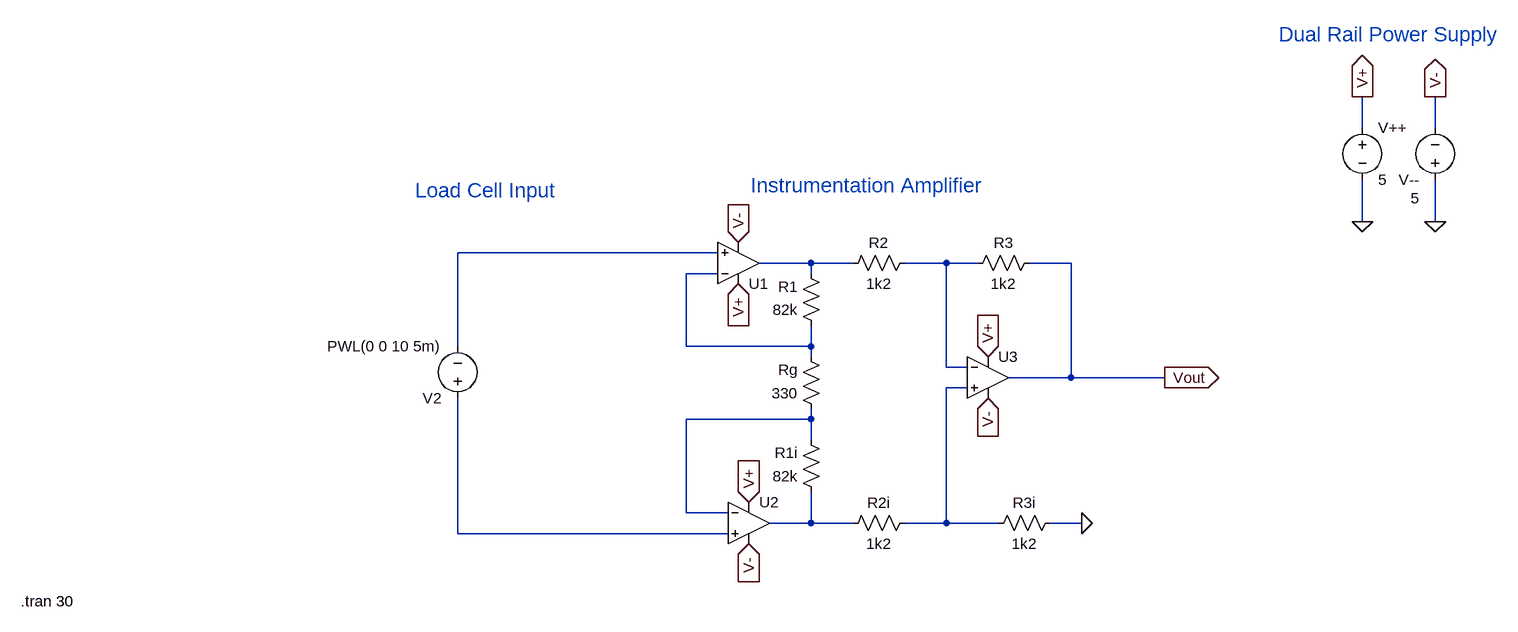
[diagram p0: schematic InstAmp.asc]
InstAmp.asc, the LTspice schematic file:
Version 4
SHEET 1 1172 680
WIRE 960 -176 960 -224
WIRE 1072 -176 1072 -224
WIRE 960 -32 960 -96
WIRE 1072 -32 1072 -96
WIRE -32 16 -432 16
WIRE 112 32 32 32
WIRE 176 32 112 32
WIRE 320 32 256 32
WIRE 368 32 320 32
WIRE 512 32 448 32
WIRE -32 48 -80 48
WIRE 112 48 112 32
WIRE -432 160 -432 16
WIRE -80 160 -80 48
WIRE 112 160 112 128
WIRE 112 160 -80 160
WIRE 112 176 112 160
WIRE 320 192 320 32
WIRE 352 192 320 192
WIRE 512 208 512 32
WIRE 512 208 416 208
WIRE 656 208 512 208
WIRE 352 224 320 224
WIRE 112 272 112 256
WIRE 112 272 -80 272
WIRE 112 304 112 272
WIRE -80 416 -80 272
WIRE -16 416 -80 416
WIRE 112 432 112 384
WIRE 112 432 48 432
WIRE 176 432 112 432
WIRE 320 432 320 224
WIRE 320 432 256 432
WIRE 400 432 320 432
WIRE 528 432 480 432
WIRE -432 448 -432 240
WIRE -16 448 -432 448
FLAG 528 432 0
FLAG 656 208 Vout
IOPIN 656 208 Out
FLAG 960 -224 V+
IOPIN 960 -224 Out
FLAG 1072 -224 V-
IOPIN 1072 -224 Out
FLAG 960 -32 0
FLAG 1072 -32 0
FLAG 384 240 V-
IOPIN 384 240 In
FLAG 16 464 V-
IOPIN 16 464 In
FLAG 0 0 V-
IOPIN 0 0 In
FLAG 0 64 V+
IOPIN 0 64 In
FLAG 16 400 V+
IOPIN 16 400 In
FLAG 384 176 V+
IOPIN 384 176 In
SYMBOL OpAmps\\UniversalOpAmp 0 32 M180
SYMATTR InstName U1
SYMBOL OpAmps\\UniversalOpAmp 16 432 R0
SYMATTR InstName U2
SYMBOL OpAmps\\UniversalOpAmp 384 208 R0
SYMATTR InstName U3
SYMBOL res 128 144 R180
WINDOW 0 36 76 Left 2
WINDOW 3 36 40 Left 2
SYMATTR InstName R1
SYMATTR Value 82k
SYMBOL res 128 272 R180
WINDOW 0 36 76 Left 2
WINDOW 3 36 40 Left 2
SYMATTR InstName Rg
SYMATTR Value 330
SYMBOL res 128 400 R180
WINDOW 0 36 76 Left 2
WINDOW 3 36 40 Left 2
SYMATTR InstName R1i
SYMATTR Value 82k
SYMBOL res 160 48 R270
WINDOW 0 32 56 VTop 2
WINDOW 3 0 56 VBottom 2
SYMATTR InstName R2
SYMATTR Value 1k2
SYMBOL res 160 448 R270
WINDOW 0 32 56 VTop 2
WINDOW 3 0 56 VBottom 2
SYMATTR InstName R2i
SYMATTR Value 1k2
SYMBOL res 384 448 R270
WINDOW 0 32 56 VTop 2
WINDOW 3 0 56 VBottom 2
SYMATTR InstName R3i
SYMATTR Value 1k2
SYMBOL res 352 48 R270
WINDOW 0 32 56 VTop 2
WINDOW 3 0 56 VBottom 2
SYMATTR InstName R3
SYMATTR Value 1k2
SYMBOL voltage 960 -192 R0
WINDOW 123 0 0 Left 0
WINDOW 39 0 0 Left 0
SYMATTR InstName V++
SYMATTR Value 5
SYMBOL voltage 1072 -80 R180
WINDOW 3 24 -12 Left 2
WINDOW 123 0 0 Left 0
WINDOW 39 0 0 Left 0
SYMATTR Value 5
SYMATTR InstName V--
SYMBOL voltage -432 256 R180
WINDOW 123 24 68 Left 2
WINDOW 39 0 0 Left 0
SYMATTR InstName V2
SYMATTR Value PWL(0 0 10 5m)
TEXT 1168 -320 Right 3 ;Dual Rail Power Supply
TEXT 376 -88 Right 3 ;Instrumentation Amplifier
TEXT -280 -80 Right 3 ;Load Cell Input
TEXT -1104 552 Left 2 !.tran 30

The netlist it stands for:
* InstAmp.asc
XU1 N001 N004 V+ V- N002 level1 Avol=1Meg GBW=10Meg Vos=0 En=0 Enk=0 In=0 Ink=0 Rin=500Meg  ; pins In+ In- V+ V- OUT
XU2 N008 N006 V+ V- N007 level1 Avol=1Meg GBW=10Meg Vos=0 En=0 Enk=0 In=0 Ink=0 Rin=500Meg  ; pins In+ In- V+ V- OUT
XU3 N005 N003 V+ V- Vout level1 Avol=1Meg GBW=10Meg Vos=0 En=0 Enk=0 In=0 Ink=0 Rin=500Meg  ; pins In+ In- V+ V- OUT
R1 N004 N002 82k
Rg N006 N004 330
R1i N007 N006 82k
R2 N002 N003 1k2
R2i N007 N005 1k2
R3i N005 0 1k2
R3 N003 Vout 1k2
V++ V+ 0 5
V-- 0 V- 5
V2 N008 N001 PWL(0 0 10 5m)
* Dual Rail Power Supply
* Instrumentation Amplifier
* Load Cell Input
.tran 30
.lib UniversalOpAmp1.lib
.backanno
.end